# EAGLE design opk-pi-1wire-i2c-v1 (EAGLE 7.3.0)
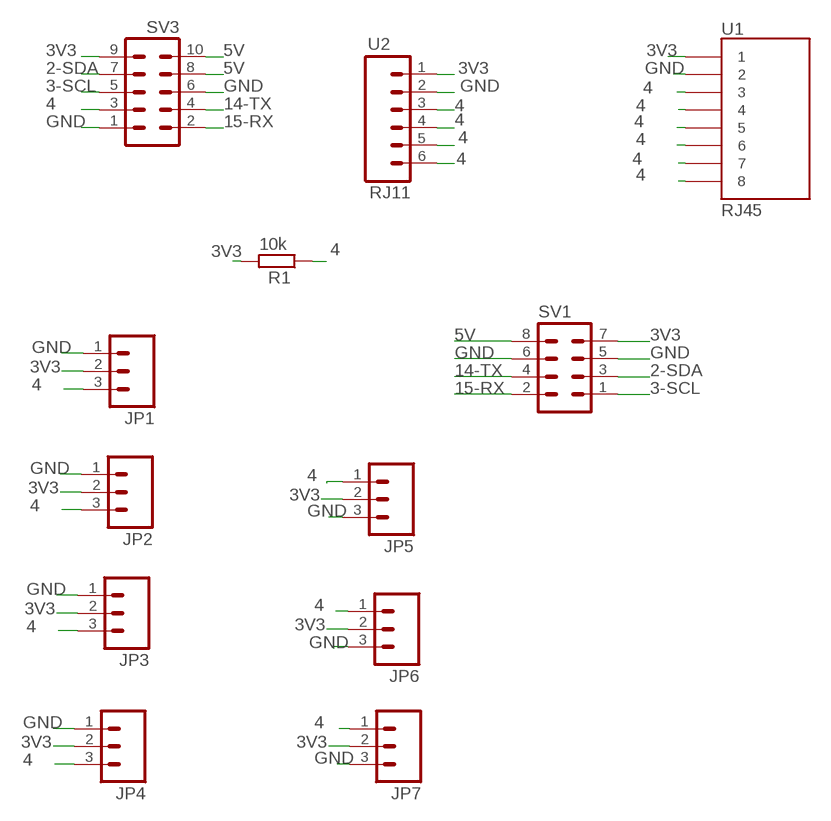
[diagram p0: schematic, sheet 1]

## Parts
JP1  M03SCREW  [SCREWTERMINAL-3.5MM-3]
JP2  M03SCREW  [SCREWTERMINAL-3.5MM-3]
JP3  M03SCREW  [SCREWTERMINAL-3.5MM-3]
JP4  M03SCREW  [SCREWTERMINAL-3.5MM-3]
JP5  M03SCREW  [SCREWTERMINAL-3.5MM-3]
JP6  M03SCREW  [SCREWTERMINAL-3.5MM-3]
JP7  M03SCREW  [SCREWTERMINAL-3.5MM-3]
R1  10k  R-EU_0204/7  [0204/7]
SV1  MA04-2  [MA04-2]
SV3  MA05-2  [MA05-2]
U1  RJ45  RJ45-8PTH  [RJ45-8]
U2  RJ11  RJ11-6PTH  [RJ11-6]

## Nets
2-SDA: SV1.3 SV3.7
3-SCL: SV1.1 SV3.5
3V3: JP1.2 JP2.2 JP3.2 JP4.2 JP5.2 JP6.2 JP7.2 R1.2 SV1.7 SV3.9 U1.1 U2.1
4: JP1.3 JP2.3 JP3.3 JP4.3 JP5.1 JP6.1 JP7.1 R1.1 SV3.3 U1.3 U1.4 U1.5 U1.6 U1.7 U1.8 U2.3 U2.4 U2.5 U2.6
5V: SV1.8 SV3.8 SV3.10
14-TX: SV1.4 SV3.4
15-RX: SV1.2 SV3.2
GND: JP1.1 JP2.1 JP3.1 JP4.1 JP5.3 JP6.3 JP7.3 SV1.5 SV1.6 SV3.1 SV3.6 U1.2 U2.2

## Library data of the parts
JP1-JP7 = SparkFun:M03: Header 3 Standard 3-pin 0.1" header. Use with straight break away headers (SKU : PRT-00116), right angle break away headers (PRT-00553), swiss pins (PRT-00743), machine pins (PRT-00117), and female headers (PRT-00115). Molex polarized connector foot print use with SKU : PRT-08232 with associated crimp pins and housings.
R1 = rcl:R-EU_: RESISTOR, European symbol
SV1 = con-lstb:MA04-2: PIN HEADER; OC_FARNELL: unknown; OC_NEWARK: unknown
SV3 = con-lstb:MA05-2: PIN HEADER; OC_FARNELL: unknown; OC_NEWARK: unknown
U1 = SparkFun:RJ45-8: RJ45 Jack Simple RJ45, 8-pin connection - connector for common Cat5, Cat5e, and Cat6 Ethernet cables. Footprint not yet proven in production. Connector sku is PRT-00643; Breakout PCB sku is BOB-00716.
U2 = SparkFun-Connectors:RJ11-6: RJ11 Jack Simple 6 pin RJ11 jack. Commonly found on CAT3 devices and Microchip programmers. SKU: PRT-00132; PROD_ID: CONN-08590

## Net classes
0 Default: width 0.203 mm
1 vcc: width 0.203 mm

## Board
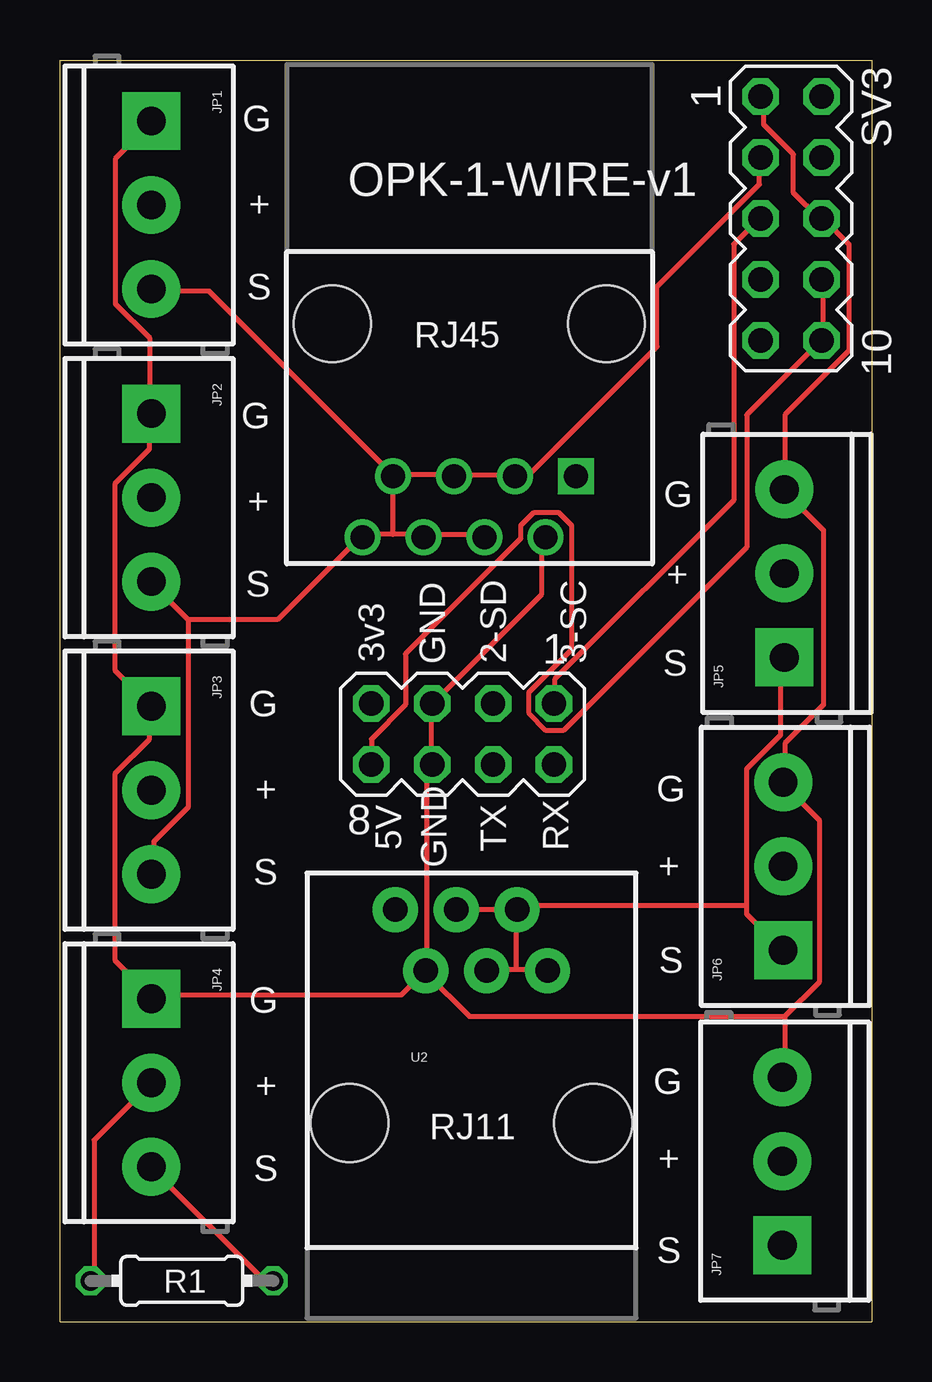
[diagram p1: board, top side]
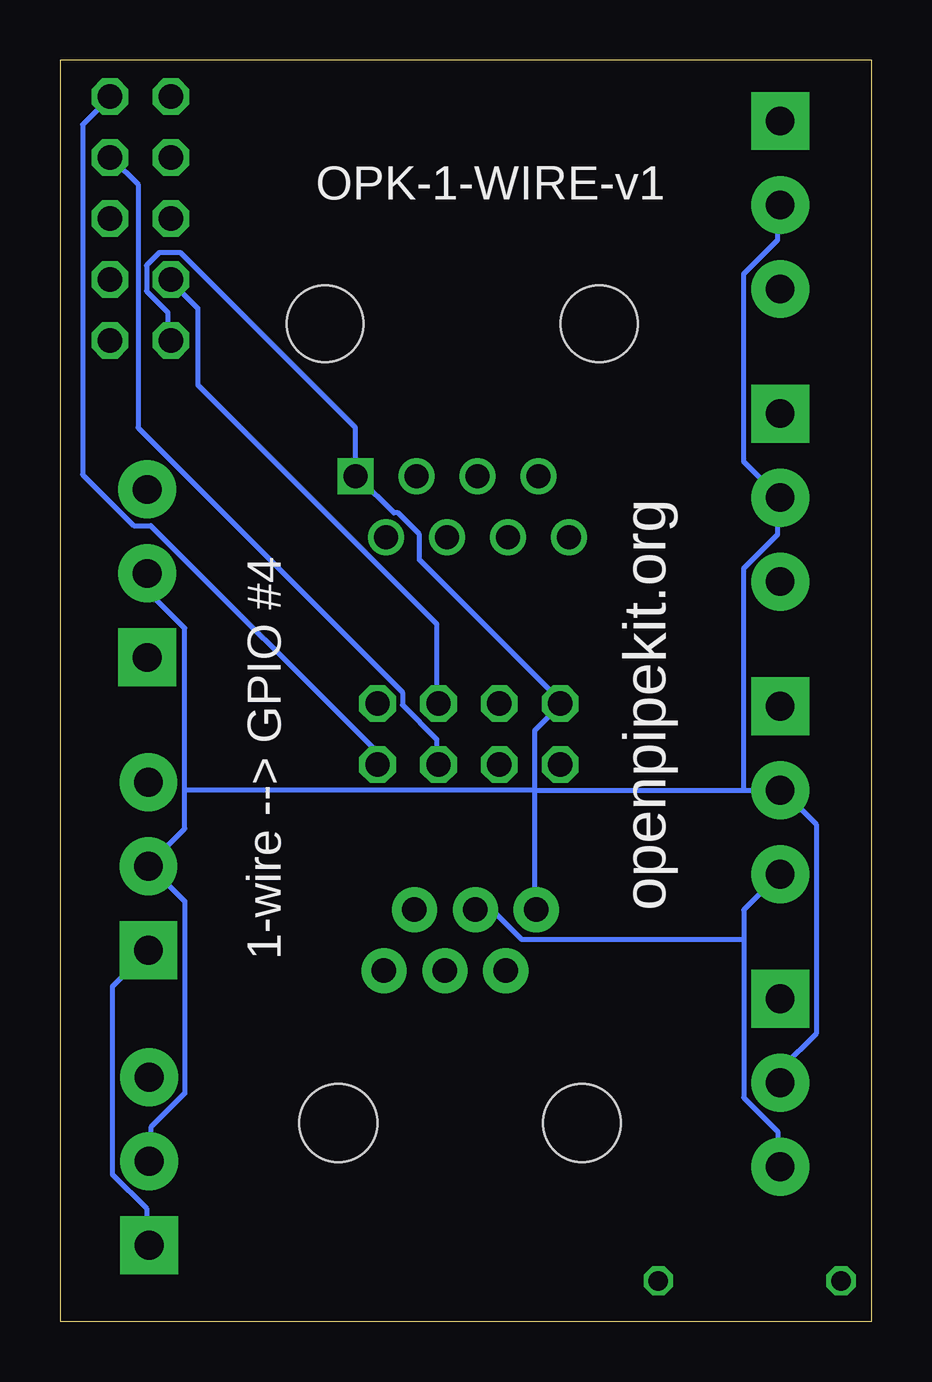
[diagram p2: board, bottom side, seen from below]

Size 33.83 x 52.58 mm. Coordinates in mm from the lower left corner, seen from the top.
Outline: 0,0 33.83,0 33.83,52.58 0,52.58 0,0
Copper layers (1*16): Top 0.0356mm / dielectric 1.5011mm / Bottom 0.0356mm
Design rules "LaenPCBOrder": minimum track width 6mil, minimum drill 13mil, track to track 6mil, track to pad 6mil, pad to pad 6mil, via to via 6mil, smd to smd 6mil, copper to edge 15mil, drill to drill 6mil, minimum pad ring 7mil, minimum via ring 7mil, stop-mask expansion 3mil, vias tented up to drill 0mil, thermal gap 10mil

### Footprints (pad centres in the part's own frame; a part is rotated, then mirrored left to right if it is on the bottom)
SCREWTERMINAL-3.5MM-3 = drill 1.2 pad 2.413 square: 1 0,0 | drill 1.2 pad 2.413: 2 3.5,0; 3 7,0
0204/7 = drill 0.813 octagon: 1 -3.81,0; 2 3.81,0
MA04-2 = drill 1.016 octagon: 1 -3.81,-1.27; 2 -3.81,1.27; 3 -1.27,-1.27; 4 -1.27,1.27; 5 1.27,-1.27; 6 1.27,1.27; 7 3.81,-1.27; 8 3.81,1.27
MA05-2 = drill 1.016 octagon: 1 -5.08,-1.27; 2 -5.08,1.27; 3 -2.54,-1.27; 4 -2.54,1.27; 5 0,-1.27; 6 0,1.27; 7 2.54,-1.27; 8 2.54,1.27; 9 5.08,-1.27; 10 5.08,1.27
RJ45-8 = drill 1 square: 1 -4.445,6.35 | drill 1: 2 -3.175,8.89; 3 -1.905,6.35; 4 -0.635,8.89; 5 0.635,6.35; 6 1.905,8.89; 7 3.175,6.35; 8 4.445,8.89 | hole 3.2: -5.715,0; 5.715,0
RJ11-6 = drill 1.016 pad 1.88: 1 -3.175,8.89; 2 -1.905,6.35; 3 -0.635,8.89; 4 0.635,6.35; 5 1.905,8.89; 6 3.175,6.35 | hole 3.251: -5.08,0; 5.08,0

### Placement (x,y rotation side)
JP1  3.81,50.04 270 top
JP2  3.81,37.85 270 top
JP3  3.81,25.65 270 top
JP4  3.81,13.46 270 top
JP5  30.2,27.69 90 top
JP6  30.15,15.48 90 top
JP7  30.12,3.2 90 top
R1  5.08,1.71 180 top
SV1  16.78,24.49 180 top
SV3  30.48,45.97 270 top
U1  17.07,41.59 180 top
U2  17.15,8.29 0 top

### Tracks (layer width: path | path; a pad name or v marks a point on that pad's centre or on a via)
2-SDA
  Bottom 0.203: SV1.3 18.14,25.88 18.14,29.08 28.09,39.04 28.09,42.24 29.16,43.31 SV3.7
3-SCL
  Top 0.203: SV1.1 20.62,25.88 20.62,26.77 28.09,34.24 28.09,44.91 29.16,45.97 SV3.5
3V3
  Top 0.203: R1.2 1.42,1.88 1.42,7.57 3.73,9.88 JP4.2
  Bottom 0.203: JP7.2 30.05,6.86 30.05,8.1 28.63,9.53 28.63,17.53 30.05,18.95 JP6.2 30.05,19.13 28.63,20.55 28.63,22.15 | 28.63,22.15 28.63,28.91 30.05,30.33 30.05,31.04 JP5.2 | SV3.9 29.34,41 29.34,42.06 30.23,42.95 30.23,44.02 29.69,44.55 28.8,44.55 21.51,37.26 21.51,35.31 U1.1 21.34,35.13 19.91,33.71 19.74,33.71 18.85,32.82 18.85,31.75 12.98,25.88 SV1.7 12.98,25.7 14.05,24.64 14.05,22.15 | 14.05,22.15 14.05,17.35 U2.1 | 14.05,22.15 5.33,22.15 | 5.33,22.15 3.91,22.15 JP3.2 3.73,22.15 2.31,20.73 2.31,12.01 3.73,10.59 3.73,10.06 JP4.2 | 5.33,22.15 5.33,31.39 3.91,32.82 3.91,34.24 JP2.2 3.91,34.42 5.33,35.84 5.33,43.66 3.91,45.08 3.91,46.51 JP1.2 | 14.05,22.15 28.63,22.15
4
  Top 0.203: 19.02,17.17 16.54,17.17 U2.3 | 19.02,14.68 20.27,14.68 U2.6 | 19.02,14.68 17.96,14.68 U2.4 | 19.02,14.68 19.02,17.17 | 19.02,17.17 U2.5 19.2,17.35 28.63,17.35 | 28.63,17.35 28.63,16.99 30.05,15.57 JP6.1 | 28.63,17.35 28.63,23.04 30.05,24.46 30.05,27.66 JP5.1 | R1.1 8.89,1.88 8.36,1.88 3.91,6.32 JP4.3 | 5.33,29.26 5.33,21.44 3.91,20.02 3.91,18.77 JP3.3 | 5.33,29.26 3.91,30.68 JP2.3 | 13.87,32.82 15.11,32.82 U1.6 15.29,32.82 17.6,32.82 U1.4 | 13.87,32.82 12.62,32.82 U1.8 12.45,32.64 9.07,29.26 5.33,29.26 | U1.7 14.05,35.31 16.36,35.31 U1.5 16.54,35.31 18.85,35.31 U1.3 19.02,35.31 19.56,35.31 24.89,40.64 24.89,43.13 29.16,47.4 29.16,48.46 SV3.3 | 13.87,32.82 13.87,35.13 U1.7 | JP1.3 3.91,42.95 6.22,42.95 13.87,35.31 U1.7
  Bottom 0.203: JP7.1 30.23,3.3 30.23,4.72 31.65,6.15 31.65,13.97 30.23,15.39 JP6.1 | 5.33,15.93 5.33,17.17 3.91,18.59 JP3.3 | 5.33,15.93 5.33,9.35 3.91,7.93 3.91,6.5 JP4.3 | 5.33,15.93 14.58,15.93 15.82,17.17 16.36,17.17 U2.3
5V
  Top 0.203: SV1.8 12.98,23.39 12.98,24.28 14.4,25.7 14.4,27.84 19.2,32.64 19.2,33.17 19.74,33.71 20.8,33.71 21.34,33.17 21.34,28.02 19.56,26.24 19.56,25.35 20.27,24.64 20.98,24.64 28.63,32.28 28.63,37.8 31.65,40.82 SV3.10 31.83,41 31.83,43.31 SV3.8
14-TX
  Bottom 0.203: SV1.4 18.14,23.39 18.14,24.28 19.56,25.7 19.56,26.24 30.58,37.26 30.58,47.4 31.65,48.46 SV3.4
15-RX
  Bottom 0.203: SV1.2 20.62,23.39 20.62,23.75 30.05,33.17 30.76,33.17 32.89,35.31 32.89,49.89 31.83,50.95 SV3.2
GND
  Top 0.203: 30.23,12.72 30.23,10.24 JP7.3 | 30.23,12.72 31.65,14.15 31.65,20.9 30.23,22.33 JP6.3 30.23,22.5 30.23,24.11 31.83,25.7 31.83,33 30.23,34.59 JP5.3 30.23,34.77 30.23,37.8 32.89,40.46 32.89,44.91 31.83,45.97 SV3.6 31.65,45.97 30.58,47.04 30.58,48.64 29.34,49.89 29.34,50.95 SV3.1 | JP1.1 3.73,49.89 2.31,48.46 2.31,42.42 3.73,41 3.73,37.97 JP2.1 3.73,37.8 3.73,36.37 2.31,34.95 2.31,27.13 3.73,25.7 JP3.1 3.73,25.53 3.73,24.28 2.31,22.86 2.31,15.04 3.73,13.61 JP4.1 3.91,13.61 14.22,13.61 15.11,14.5 U2.2 | U1.2 20.09,32.64 20.09,30.33 15.65,25.88 SV1.5 15.47,25.7 15.47,23.39 SV1.6 15.47,23.22 15.29,23.04 15.29,14.68 U2.2 | 30.23,12.72 17.07,12.72 15.29,14.5 U2.2

### Text on the board
tPlace: G | OPK-1-WIRE-v1 | + | S | RJ45 | G | + | G | S | + | 3v3 | GND | 2-SD | 3-SC | S | G | + | G | 5V | TX | RX | S | GND | + | S | G | + | G | RJ11 | S | + | S
bPlace: OPK-1-WIRE-v1 | openpipekit.org | 1-wire --> GPIO #4